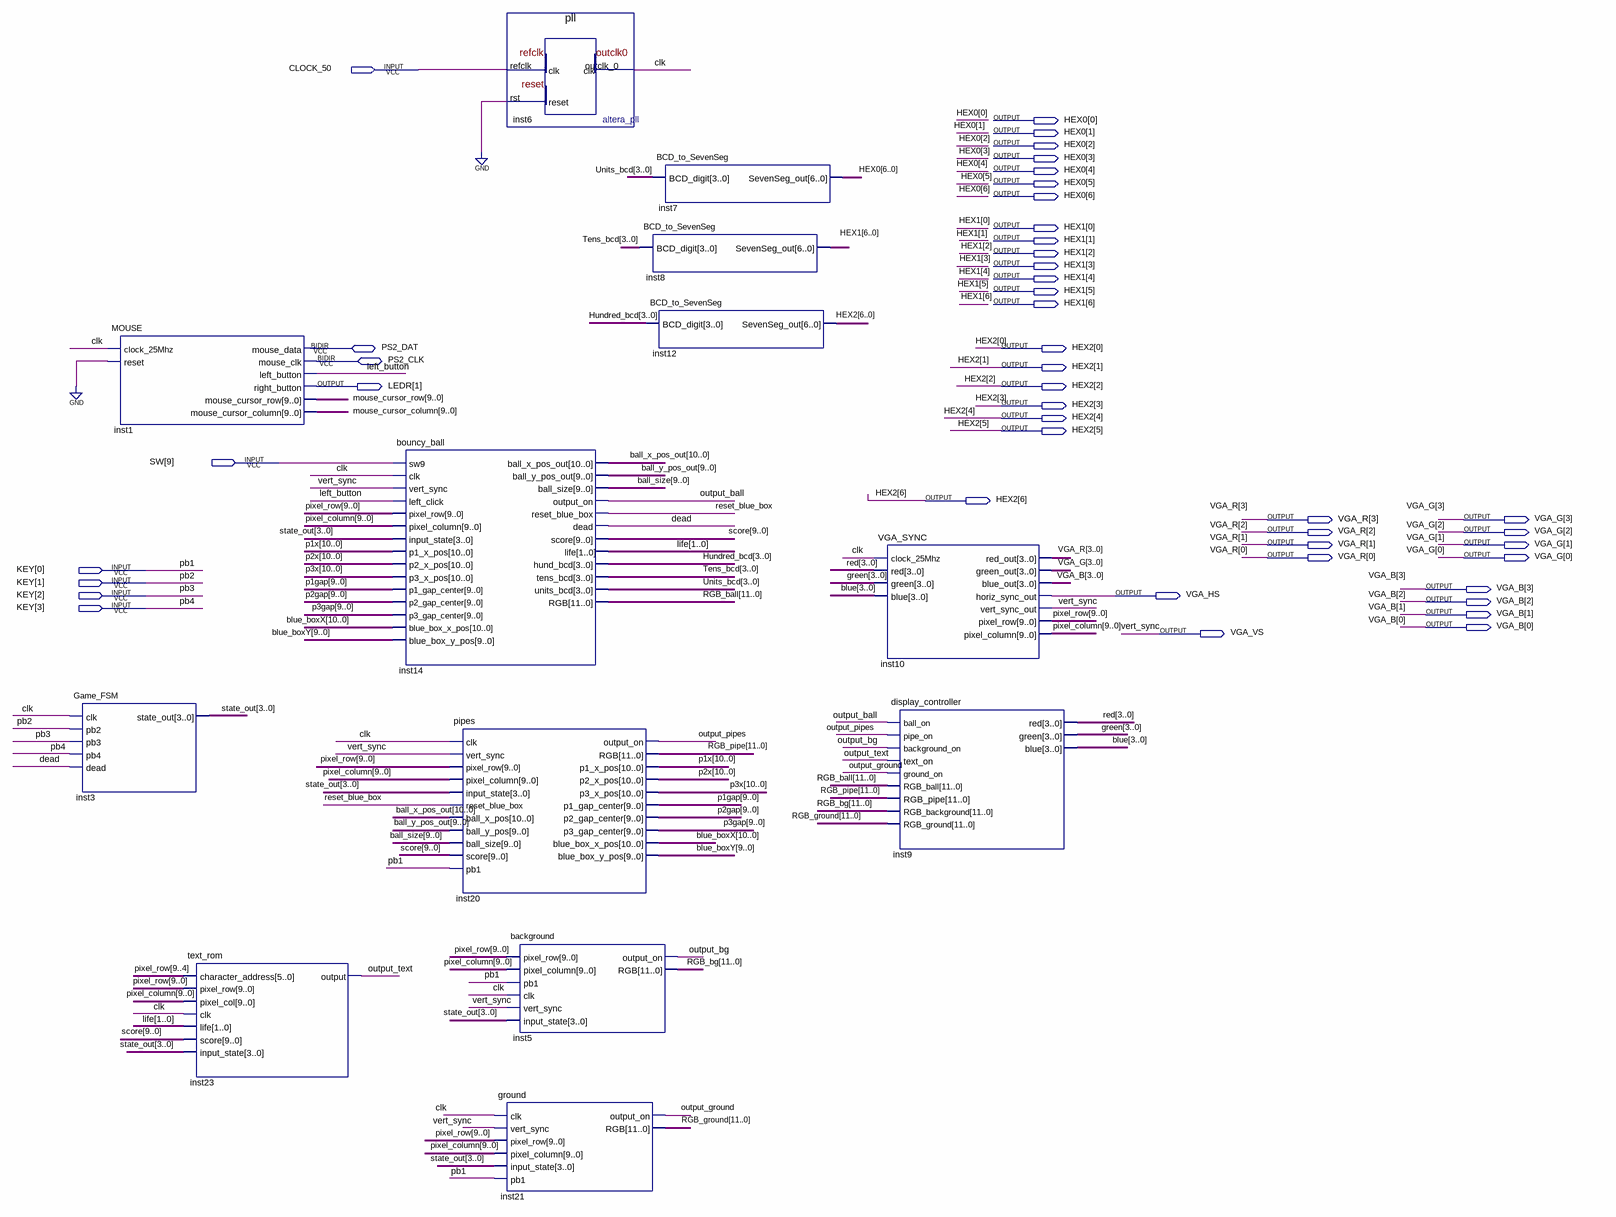
[diagram p0: schematic sheet]
// Quartus schematic flappybird21block.bdf as structural Verilog: 13 symbols, 44 pins
module flappybird21block (
  input  CLOCK_50,
  input  [9:9] SW,
  input  [3:0] KEY,
  inout  PS2_DAT,
  inout  PS2_CLK,
  output [6:0] HEX0,
  output [6:0] HEX1,
  output [6:0] HEX2,
  output [1:1] LEDR,
  output [3:0] VGA_R,
  output [3:0] VGA_G,
  output [3:0] VGA_B,
  output VGA_HS,
  output VGA_VS
);

  wire clk, dead, left_button, output_ball, output_bg, output_ground, output_pipes, output_text,
       reset_blue_box;
  wire [1:0] life;
  wire [3:0] blue, green, Hundred_bcd, red, state_out, Tens_bcd, Units_bcd;
  wire [9:0] ball_size, ball_y_pos_out, blue_boxY, mouse_cursor_column, mouse_cursor_row, p1gap, p2gap,
       p3gap, pixel_column, pixel_row, score;
  wire [10:0] ball_x_pos_out, blue_boxX, p1x, p2x, p3x;
  wire [11:0] RGB_ball, RGB_bg, RGB_ground, RGB_pipe;

  Game_FSM inst3 (.clk(clk), .pb2(KEY[1]), .pb3(KEY[2]), .pb4(KEY[3]), .dead(dead), .state_out(state_out));
  MOUSE inst1 (
    .clock_25Mhz(clk), .reset(1'b0), .left_button(left_button), .right_button(LEDR[1]),
    .mouse_cursor_row(mouse_cursor_row), .mouse_cursor_column(mouse_cursor_column), .mouse_data(PS2_DAT),
    .mouse_clk(PS2_CLK));
  text_rom inst23 (
    .character_address(pixel_row[9:4]), .pixel_row(pixel_row), .pixel_col(pixel_column), .clk(clk),
    .life(life), .score(score), .input_state(state_out), .\output (output_text));
  bouncy_ball inst14 (
    .sw9(SW[9]), .clk(clk), .vert_sync(VGA_VS), .left_click(left_button), .pixel_row(pixel_row),
    .pixel_column(pixel_column), .input_state(state_out), .p1_x_pos(p1x), .p2_x_pos(p2x), .p3_x_pos(p3x),
    .p1_gap_center(p1gap), .p2_gap_center(p2gap), .p3_gap_center(p3gap), .blue_box_x_pos(blue_boxX),
    .blue_box_y_pos(blue_boxY), .ball_x_pos_out(ball_x_pos_out), .ball_y_pos_out(ball_y_pos_out),
    .ball_size(ball_size), .output_on(output_ball), .reset_blue_box(reset_blue_box), .dead(dead),
    .score(score), .life(life), .hund_bcd(Hundred_bcd), .tens_bcd(Tens_bcd), .units_bcd(Units_bcd),
    .RGB(RGB_ball));
  pipes inst20 (
    .clk(clk), .vert_sync(VGA_VS), .pixel_row(pixel_row), .pixel_column(pixel_column),
    .input_state(state_out), .reset_blue_box(reset_blue_box), .ball_x_pos(ball_x_pos_out),
    .ball_y_pos(ball_y_pos_out), .ball_size(ball_size), .score(score), .pb1(KEY[0]),
    .output_on(output_pipes), .RGB(RGB_pipe), .p1_x_pos(p1x), .p2_x_pos(p2x), .p3_x_pos(p3x),
    .p1_gap_center(p1gap), .p2_gap_center(p2gap), .p3_gap_center(p3gap), .blue_box_x_pos(blue_boxX),
    .blue_box_y_pos(blue_boxY));
  pll inst6 (.refclk(CLOCK_50), .rst(1'b0), .outclk_0(clk));
  background inst5 (
    .pixel_row(pixel_row), .pixel_column(pixel_column), .pb1(KEY[0]), .clk(clk), .vert_sync(VGA_VS),
    .input_state(state_out), .output_on(output_bg), .RGB(RGB_bg));
  ground inst21 (
    .clk(clk), .vert_sync(VGA_VS), .pixel_row(pixel_row), .pixel_column(pixel_column),
    .input_state(state_out), .pb1(KEY[0]), .output_on(output_ground), .RGB(RGB_ground));
  BCD_to_SevenSeg inst7 (.BCD_digit(Units_bcd), .SevenSeg_out(HEX0));
  BCD_to_SevenSeg inst8 (.BCD_digit(Tens_bcd), .SevenSeg_out(HEX1));
  BCD_to_SevenSeg inst12 (.BCD_digit(Hundred_bcd), .SevenSeg_out(HEX2));
  VGA_SYNC inst10 (
    .clock_25Mhz(clk), .red(red), .green(green), .blue(blue), .red_out(VGA_R), .green_out(VGA_G),
    .blue_out(VGA_B), .horiz_sync_out(VGA_HS), .vert_sync_out(VGA_VS), .pixel_row(pixel_row),
    .pixel_column(pixel_column));
  display_controller inst9 (
    .ball_on(output_ball), .pipe_on(output_pipes), .background_on(output_bg), .text_on(output_text),
    .ground_on(output_ground), .RGB_ball(RGB_ball), .RGB_pipe(RGB_pipe), .RGB_background(RGB_bg),
    .RGB_ground(RGB_ground), .red(red), .green(green), .blue(blue));

  // Other names for the same wires on the sheet: pb1 = KEY[0]; pb2 = KEY[1]; pb3 = KEY[2]; pb4 = KEY[3];
  //   vert_sync = VGA_VS
endmodule
